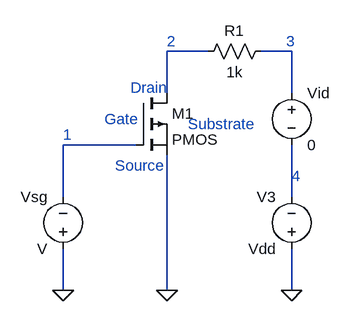
[diagram p0: schematic p-MOSFET.asc]
p-MOSFET.asc, the LTspice schematic file:
Version 4
SHEET 1 880 680
WIRE 368 176 304 176
WIRE 496 176 448 176
WIRE 304 240 304 176
WIRE 496 240 496 176
WIRE 256 320 144 320
WIRE 144 400 144 320
WIRE 496 400 496 320
WIRE 144 544 144 480
WIRE 304 544 304 336
WIRE 496 544 496 480
FLAG 144 544 0
FLAG 496 544 0
FLAG 304 544 0
SYMBOL pmos 256 240 R0
SYMATTR InstName M1
SYMBOL voltage 144 496 R180
WINDOW 0 24 96 Left 2
WINDOW 3 24 16 Left 2
SYMATTR InstName Vsg
SYMBOL voltage 496 224 R0
SYMATTR InstName Vid
SYMATTR Value 0
SYMBOL voltage 496 496 R180
WINDOW 0 24 96 Left 2
WINDOW 3 24 16 Left 2
SYMATTR InstName V3
SYMATTR Value Vdd
SYMBOL res 464 160 R90
WINDOW 0 0 56 VBottom 2
WINDOW 3 32 56 VTop 2
SYMATTR InstName R1
SYMATTR Value 1k
TEXT 144 304 Left 2 ;1
TEXT 304 160 Left 2 ;2
TEXT 488 160 Left 2 ;3
TEXT 496 368 Left 2 ;4
TEXT 208 280 Left 2 ;Gate
TEXT 224 352 Left 2 ;Source
TEXT 248 232 Left 2 ;Drain
TEXT 336 288 Left 2 ;Substrate

The netlist it stands for:
* p-MOSFET.asc
M1 N001 N003 0 0 PMOS
Vsg 0 N003 V
Vid N002 N004 0
V3 0 N004 Vdd
R1 N002 N001 1k
.model NMOS NMOS
.model PMOS PMOS
.lib standard.mos
* 1
* 2
* 3
* 4
* Gate
* Source
* Drain
* Substrate
.backanno
.end